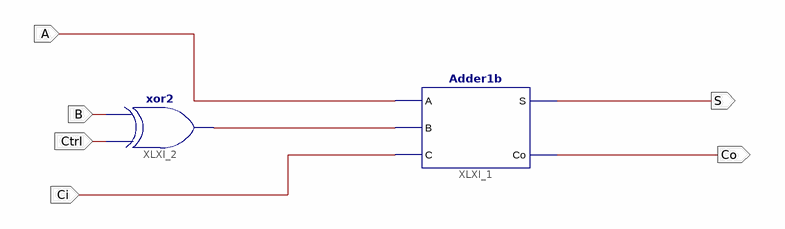
[diagram p0: schematic sheet 1]
// Xilinx ISE schematic AddSub1b.sch (kintex7) as structural Verilog: 2 symbols, 6 ports
module AddSub1b (
  input  A,
  input  Ci,
  input  B,
  input  Ctrl,
  output S,
  output Co
);

  wire XLXN_1;

  Adder1b XLXI_1 (.A(A), .B(XLXN_1), .C(Ci), .S(S), .Co(Co));
  xor XLXI_2 (XLXN_1, Ctrl, B);
endmodule
